# Altium schematic sheet FPGA_Altera_Stratix10_Nios_Dev_Board.SchDoc: Example for Altera Stratix10 Nios Board
size B; Organization: Altium Limited; Address1: L3, 12a Rodborough Rd; Address2: Frenchs Forest; Address3: NSW; Address4: Australia 2086; DocumentNumber: 1; SheetNumber: 1; SheetTotal: 1
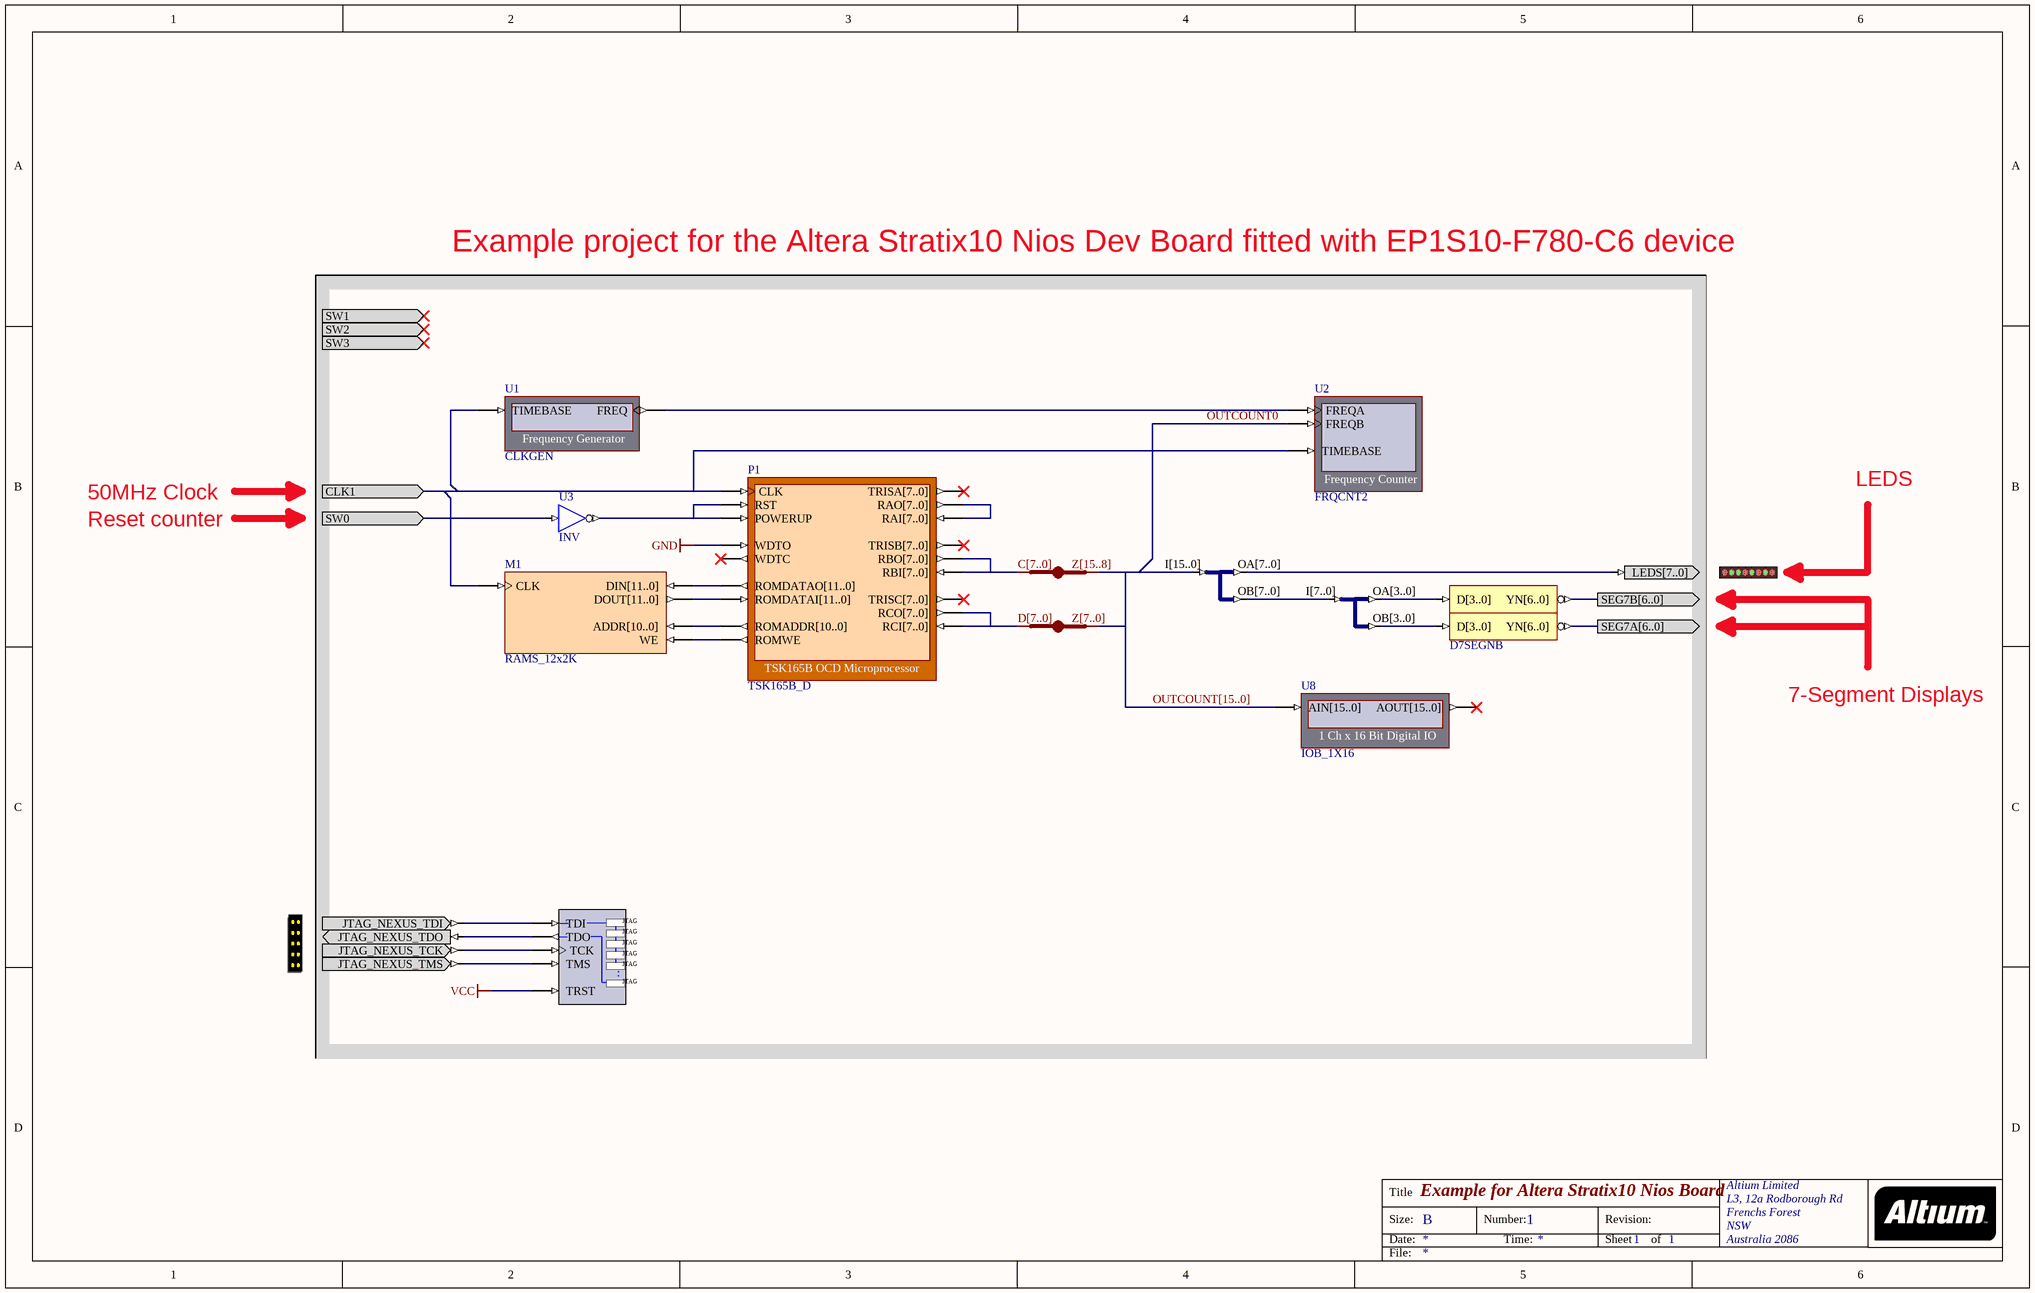
[diagram p0: FPGA_Altera_Stratix10_Nios_Dev_Board.SchDoc]

## Parts
(Parts that share a designator on the sheet are numbered #1, #2 ... from top to bottom, then left to right.)
?#1  LED  (value not drawn)
?#2  NEXUS_JTAG_CONNECTOR  (value not drawn)
JB_S1  IndexA: C[7..0]  IndexB: Z[15..8]  (hidden comment: JB)
JB_S2  IndexA: D[7..0]  IndexB: Z[7..0]  (hidden comment: JB)
M1  RAMS_12x2K
NEXUS_JTAG_PORT  NEXUS_JTAG_PORT  (value not drawn)
P1  TSK165B_D
U1  CLKGEN
U2  FRQCNT2
U3  INV
U4  J16B_8B2  (value not drawn)
U5  D7SEGNB  (value not drawn)
U6  D7SEGNB
U7  J8B_4B2  (value not drawn)
U8  IOB_1X16

## Ports
CLK1 (in), SEG7A[6..0] (out), SEG7B[6..0] (out), SW0 (in), SW1 (in), SW2 (in), SW3 (in)

## Nets
GND: P1.WDTO
VCC: NEXUS_JTAG_PORT.TRST
CLK1: M1.CLK P1.CLK U1.TIMEBASE U2.TIMEBASE ; port CLK1
OUTCOUNT0: U2.FREQB
OUTCOUNT[15..0]: JB_S1.B[0..0] JB_S2.B[0..0] U4.I[15..0] U8.AIN[15..0]
SEG7A[6..0]: U6.YN[6..0] ; port SEG7A[6..0]
SEG7B[6..0]: U5.YN[6..0] ; port SEG7B[6..0]
SW0: U3.I ; port SW0
Net?#1_LEDS[7..0]: ?#1.LEDS[7..0] U4.OA[7..0]
Net?#2_JTAG_NEXUS_TCK: ?#2.JTAG_NEXUS_TCK NEXUS_JTAG_PORT.TCK
Net?#2_JTAG_NEXUS_TDI: ?#2.JTAG_NEXUS_TDI NEXUS_JTAG_PORT.TDI
Net?#2_JTAG_NEXUS_TDO: ?#2.JTAG_NEXUS_TDO NEXUS_JTAG_PORT.TDO
Net?#2_JTAG_NEXUS_TMS: ?#2.JTAG_NEXUS_TMS NEXUS_JTAG_PORT.TMS
NetJB_S1_A[0..0]: JB_S1.A[0..0] P1.RBI[7..0] P1.RBO[7..0]
NetJB_S2_A[0..0]: JB_S2.A[0..0] P1.RCI[7..0] P1.RCO[7..0]
NetM1_ADDR[10..0]: M1.ADDR[10..0] P1.ROMADDR[10..0]
NetM1_DIN[11..0]: M1.DIN[11..0] P1.ROMDATAO[11..0]
NetM1_DOUT[11..0]: M1.DOUT[11..0] P1.ROMDATAI[11..0]
NetM1_WE: M1.WE P1.ROMWE
NetP1_POWERUP: P1.POWERUP P1.RST U3.O
NetP1_RAI[7..0]: P1.RAI[7..0] P1.RAO[7..0]
NetU1_FREQ: U1.FREQ U2.FREQA
NetU4_OB[7..0]: U4.OB[7..0] U7.I[7..0]
NetU5_D[3..0]: U5.D[3..0] U7.OA[3..0]
NetU6_D[3..0]: U6.D[3..0] U7.OB[3..0]

Not connected (* = marked no-connect by the designer): P1 TRISA[7..0]* TRISB[7..0]* TRISC[7..0]* WDTC*; U8 AOUT[15..0]*

## Buses and harness runs
bus OUTCOUNT[15..0]

## Notes on the sheet
- Example project for the Altera Stratix10 Nios Dev Board fitted with EP1S10-F780-C6 device
- 50MHz Clock
- LEDS
- Reset counter
- 7-Segment Displays
- Title
- Size:
- Date:
- B
- Number:
- Time:
- Revision:
- Sheet
- of
- File:
- (in symbol NEXUS_JTAG_PORT) JTAG; .

## Library data of the parts
?#1 = LED: 8-Way LEDS; PortComponent: True; Published: 19-Nov-2003; Publisher: Altium Limited
?#2 = NEXUS_JTAG_CONNECTOR: JTAG Port; PortComponent: True; Published: 19-Nov-2003; Publisher: Altium Limited
JB_S1 JB_S2 = JB: System BUS Joiner; ArchiveName: GENERIC; Published: 18-Dec-2003; Publisher: Altium Limited; Core Revision: 1.00.00
M1 = RAMS_12x2K: Single Port Random Access Memory; Memory_Depth: 2048; Memory_Type: RAM_SinglePortBlock; Memory_Width: 12; Memory_ClockEdge: Rising; Nexus_Core: Memory_Program; Published: 13/01/2004; Publisher: Altium Hobart Technology Center
NEXUS_JTAG_PORT = NEXUS_JTAG_PORT: Soft Nexus-Chain Connector; NEXUS_JTAG_CONNECTOR: True; Published: 18-Dec-2003; Publisher: Altium Limited
P1 = TSK165B_D: TSK165B OCD Microprocessor; NEXUS_CORE: Processor_OCDS; NEXUS_JTAG_DEVICE: True; NEXUS_JTAG_ORDER: 0; ChildModel1: TSK165B_D_RAM128x8; ChildCore1: M1; Published: 1/12/2003; Publisher: Altium Hobart Technology Centre; Core Revision: 1.00.00
U1 = CLKGEN: Frequency Generator; NEXUS_CORE: Instrument; NEXUS_JTAG_DEVICE: True; NEXUS_JTAG_ORDER: 0; Published: 30/09/2003; Publisher: Altium Hobart Technology Centre; Core Revision: 1.00.00
U2 = FRQCNT2: Frequency Counter; NEXUS_CORE: Instrument; NEXUS_JTAG_DEVICE: True; NEXUS_JTAG_ORDER: 0; Published: 30/09/2003; Publisher: Altium Hobart Technology Centre; Core Revision: 1.00.00
U3 = INV: Inverter; ArchiveName: GENERIC; Published: 18-Nov-2003; Publisher: Altium Limited; Xilinx Equivalent: INV; Core Revision: 1.00.00
U4 = J16B_8B2: 1 x 16-bit input bus to 2 x 8-Bit output bus; ArchiveName: GENERIC; Published: 18-Dec-2003; Publisher: Altium Limited; Core Revision: 1.00.00
U5 U6 = D7SEGNB: 7-Segment-Display Decoder for Common-Anode LED (Active Low Output), Bus Version; ArchiveName: GENERIC; Published: 18-Dec-2003; Publisher: Altium Limited; Core Revision: 1.00.00
U7 = J8B_4B2: 1 x 8-bit input bus to 2 x 4-Bit output bus; ArchiveName: GENERIC; Published: 18-Dec-2003; Publisher: Altium Limited; Core Revision: 1.00.00
U8 = IOB_1X16: 1 Ch x 16 Bit Digital IO; NEXUS_CORE: Instrument; NEXUS_JTAG_DEVICE: True; NEXUS_JTAG_ORDER: 0; Published: 30/09/2003; Publisher: Altium Hobart Technology Centre; Core Revision: 1.00.00